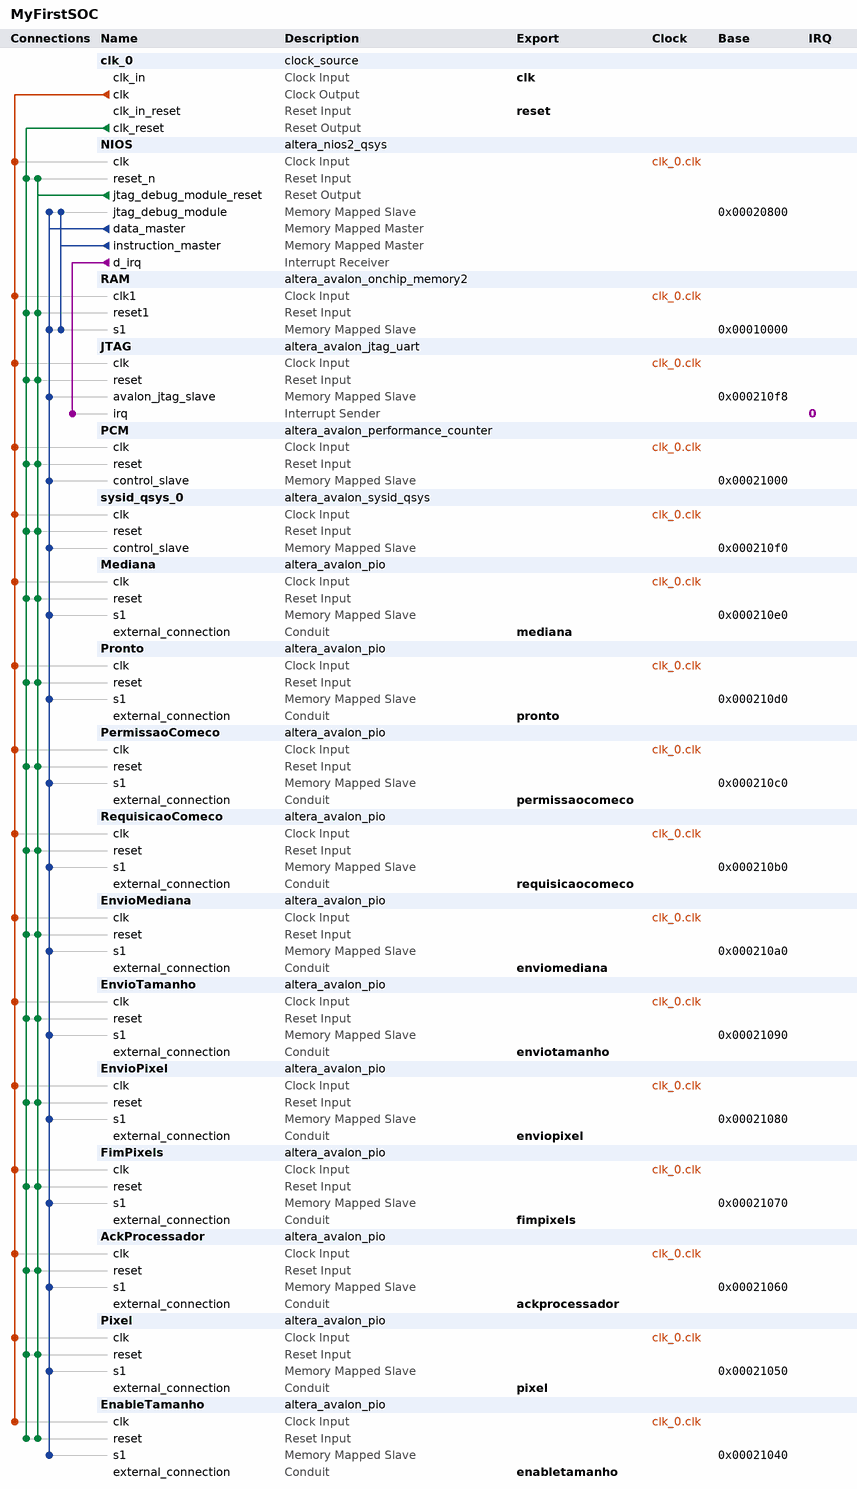
[diagram p0: system contents]
# Platform Designer (Qsys) system MyFirstSOC, Cyclone III EP3C25F324C6
# Parameters at their usual value, and those the tool derives, are not listed.
package require -exact qsys 13.1
create_system MyFirstSOC
set_project_property DEVICE_FAMILY {Cyclone III}
set_project_property DEVICE EP3C25F324C6

add_instance clk_0 clock_source 13.1
set_instance_parameter_value clk_0 clockFrequency 50000000

add_instance NIOS altera_nios2_qsys 13.1
set_instance_parameter_value NIOS resetSlave RAM.s1
set_instance_parameter_value NIOS mmu_TLBMissExcSlave None
set_instance_parameter_value NIOS exceptionSlave RAM.s1
set_instance_parameter_value NIOS breakSlave NIOS.jtag_debug_module
set_instance_parameter_value NIOS impl Tiny
set_instance_parameter_value NIOS icache_size 4096

add_instance RAM altera_avalon_onchip_memory2 13.1
set_instance_parameter_value RAM dataWidth 16
set_instance_parameter_value RAM dualPort false
set_instance_parameter_value RAM initMemContent true
set_instance_parameter_value RAM initializationFileName onchip_mem.hex
set_instance_parameter_value RAM memorySize 40960

add_instance JTAG altera_avalon_jtag_uart 13.1
set_instance_parameter_value JTAG simInteractiveOptions NO_INTERACTIVE_WINDOWS

add_instance PCM altera_avalon_performance_counter 13.1
set_instance_parameter_value PCM numberOfSections 3

add_instance sysid_qsys_0 altera_avalon_sysid_qsys 13.1
set_instance_parameter_value sysid_qsys_0 id 0

add_instance Mediana altera_avalon_pio 13.1
set_instance_parameter_value Mediana direction Output
set_instance_parameter_value Mediana width 8

add_instance Pronto altera_avalon_pio 13.1
set_instance_parameter_value Pronto direction Output
set_instance_parameter_value Pronto width 1

add_instance PermissaoComeco altera_avalon_pio 13.1
set_instance_parameter_value PermissaoComeco direction Output
set_instance_parameter_value PermissaoComeco width 1

add_instance RequisicaoComeco altera_avalon_pio 13.1
set_instance_parameter_value RequisicaoComeco direction Input
set_instance_parameter_value RequisicaoComeco width 1

add_instance EnvioMediana altera_avalon_pio 13.1
set_instance_parameter_value EnvioMediana direction Input
set_instance_parameter_value EnvioMediana width 1

add_instance EnvioTamanho altera_avalon_pio 13.1
set_instance_parameter_value EnvioTamanho direction Input
set_instance_parameter_value EnvioTamanho width 1

add_instance EnvioPixel altera_avalon_pio 13.1
set_instance_parameter_value EnvioPixel direction Input
set_instance_parameter_value EnvioPixel width 1

add_instance FimPixels altera_avalon_pio 13.1
set_instance_parameter_value FimPixels direction Input
set_instance_parameter_value FimPixels width 1

add_instance AckProcessador altera_avalon_pio 13.1
set_instance_parameter_value AckProcessador direction Input
set_instance_parameter_value AckProcessador width 1

add_instance Pixel altera_avalon_pio 13.1
set_instance_parameter_value Pixel direction Input
set_instance_parameter_value Pixel width 8

add_instance EnableTamanho altera_avalon_pio 13.1
set_instance_parameter_value EnableTamanho direction Input
set_instance_parameter_value EnableTamanho width 2

# connections
add_connection clk_0.clk AckProcessador.clk clock
add_connection clk_0.clk EnableTamanho.clk clock
add_connection clk_0.clk EnvioMediana.clk clock
add_connection clk_0.clk EnvioPixel.clk clock
add_connection clk_0.clk EnvioTamanho.clk clock
add_connection clk_0.clk FimPixels.clk clock
add_connection clk_0.clk JTAG.clk clock
add_connection clk_0.clk Mediana.clk clock
add_connection clk_0.clk NIOS.clk clock
add_connection clk_0.clk PCM.clk clock
add_connection clk_0.clk PermissaoComeco.clk clock
add_connection clk_0.clk Pixel.clk clock
add_connection clk_0.clk Pronto.clk clock
add_connection clk_0.clk RAM.clk1 clock
add_connection clk_0.clk RequisicaoComeco.clk clock
add_connection clk_0.clk sysid_qsys_0.clk clock
add_connection clk_0.clk_reset AckProcessador.reset reset
add_connection clk_0.clk_reset EnableTamanho.reset reset
add_connection clk_0.clk_reset EnvioMediana.reset reset
add_connection clk_0.clk_reset EnvioPixel.reset reset
add_connection clk_0.clk_reset EnvioTamanho.reset reset
add_connection clk_0.clk_reset FimPixels.reset reset
add_connection clk_0.clk_reset JTAG.reset reset
add_connection clk_0.clk_reset Mediana.reset reset
add_connection clk_0.clk_reset NIOS.reset_n reset
add_connection clk_0.clk_reset PCM.reset reset
add_connection clk_0.clk_reset PermissaoComeco.reset reset
add_connection clk_0.clk_reset Pixel.reset reset
add_connection clk_0.clk_reset Pronto.reset reset
add_connection clk_0.clk_reset RAM.reset1 reset
add_connection clk_0.clk_reset RequisicaoComeco.reset reset
add_connection clk_0.clk_reset sysid_qsys_0.reset reset
add_connection NIOS.jtag_debug_module_reset AckProcessador.reset reset
add_connection NIOS.jtag_debug_module_reset EnableTamanho.reset reset
add_connection NIOS.jtag_debug_module_reset EnvioMediana.reset reset
add_connection NIOS.jtag_debug_module_reset EnvioPixel.reset reset
add_connection NIOS.jtag_debug_module_reset EnvioTamanho.reset reset
add_connection NIOS.jtag_debug_module_reset FimPixels.reset reset
add_connection NIOS.jtag_debug_module_reset JTAG.reset reset
add_connection NIOS.jtag_debug_module_reset Mediana.reset reset
add_connection NIOS.jtag_debug_module_reset NIOS.reset_n reset
add_connection NIOS.jtag_debug_module_reset PCM.reset reset
add_connection NIOS.jtag_debug_module_reset PermissaoComeco.reset reset
add_connection NIOS.jtag_debug_module_reset Pixel.reset reset
add_connection NIOS.jtag_debug_module_reset Pronto.reset reset
add_connection NIOS.jtag_debug_module_reset RAM.reset1 reset
add_connection NIOS.jtag_debug_module_reset RequisicaoComeco.reset reset
add_connection NIOS.jtag_debug_module_reset sysid_qsys_0.reset reset
add_connection NIOS.data_master AckProcessador.s1 avalon
set_connection_parameter_value NIOS.data_master/AckProcessador.s1 baseAddress 0x00021060
add_connection NIOS.data_master EnableTamanho.s1 avalon
set_connection_parameter_value NIOS.data_master/EnableTamanho.s1 baseAddress 0x00021040
add_connection NIOS.data_master EnvioMediana.s1 avalon
set_connection_parameter_value NIOS.data_master/EnvioMediana.s1 baseAddress 0x000210a0
add_connection NIOS.data_master EnvioPixel.s1 avalon
set_connection_parameter_value NIOS.data_master/EnvioPixel.s1 baseAddress 0x00021080
add_connection NIOS.data_master EnvioTamanho.s1 avalon
set_connection_parameter_value NIOS.data_master/EnvioTamanho.s1 baseAddress 0x00021090
add_connection NIOS.data_master FimPixels.s1 avalon
set_connection_parameter_value NIOS.data_master/FimPixels.s1 baseAddress 0x00021070
add_connection NIOS.data_master JTAG.avalon_jtag_slave avalon
set_connection_parameter_value NIOS.data_master/JTAG.avalon_jtag_slave baseAddress 0x000210f8
add_connection NIOS.data_master Mediana.s1 avalon
set_connection_parameter_value NIOS.data_master/Mediana.s1 baseAddress 0x000210e0
add_connection NIOS.data_master NIOS.jtag_debug_module avalon
set_connection_parameter_value NIOS.data_master/NIOS.jtag_debug_module baseAddress 0x00020800
add_connection NIOS.data_master PCM.control_slave avalon
set_connection_parameter_value NIOS.data_master/PCM.control_slave baseAddress 0x00021000
add_connection NIOS.data_master PermissaoComeco.s1 avalon
set_connection_parameter_value NIOS.data_master/PermissaoComeco.s1 baseAddress 0x000210c0
add_connection NIOS.data_master Pixel.s1 avalon
set_connection_parameter_value NIOS.data_master/Pixel.s1 baseAddress 0x00021050
add_connection NIOS.data_master Pronto.s1 avalon
set_connection_parameter_value NIOS.data_master/Pronto.s1 baseAddress 0x000210d0
add_connection NIOS.data_master RAM.s1 avalon
set_connection_parameter_value NIOS.data_master/RAM.s1 baseAddress 0x00010000
add_connection NIOS.data_master RequisicaoComeco.s1 avalon
set_connection_parameter_value NIOS.data_master/RequisicaoComeco.s1 baseAddress 0x000210b0
add_connection NIOS.data_master sysid_qsys_0.control_slave avalon
set_connection_parameter_value NIOS.data_master/sysid_qsys_0.control_slave baseAddress 0x000210f0
add_connection NIOS.instruction_master NIOS.jtag_debug_module avalon
set_connection_parameter_value NIOS.instruction_master/NIOS.jtag_debug_module baseAddress 0x00020800
add_connection NIOS.instruction_master RAM.s1 avalon
set_connection_parameter_value NIOS.instruction_master/RAM.s1 baseAddress 0x00010000
add_connection NIOS.d_irq JTAG.irq interrupt
set_connection_parameter_value NIOS.d_irq/JTAG.irq irqNumber 0

# exported interfaces
add_interface clk clock sink
set_interface_property clk EXPORT_OF clk_0.clk_in
add_interface reset reset sink
set_interface_property reset EXPORT_OF clk_0.clk_in_reset
add_interface pronto conduit end
set_interface_property pronto EXPORT_OF Pronto.external_connection
add_interface permissaocomeco conduit end
set_interface_property permissaocomeco EXPORT_OF PermissaoComeco.external_connection
add_interface requisicaocomeco conduit end
set_interface_property requisicaocomeco EXPORT_OF RequisicaoComeco.external_connection
add_interface mediana conduit end
set_interface_property mediana EXPORT_OF Mediana.external_connection
add_interface enviomediana conduit end
set_interface_property enviomediana EXPORT_OF EnvioMediana.external_connection
add_interface enviotamanho conduit end
set_interface_property enviotamanho EXPORT_OF EnvioTamanho.external_connection
add_interface enviopixel conduit end
set_interface_property enviopixel EXPORT_OF EnvioPixel.external_connection
add_interface fimpixels conduit end
set_interface_property fimpixels EXPORT_OF FimPixels.external_connection
add_interface ackprocessador conduit end
set_interface_property ackprocessador EXPORT_OF AckProcessador.external_connection
add_interface pixel conduit end
set_interface_property pixel EXPORT_OF Pixel.external_connection
add_interface enabletamanho conduit end
set_interface_property enabletamanho EXPORT_OF EnableTamanho.external_connection

set_interconnect_requirement {$system} qsys_mm.clockCrossingAdapter HANDSHAKE
set_interconnect_requirement {$system} qsys_mm.maxAdditionalLatency 1
set_interconnect_requirement {$system} qsys_mm.insertDefaultSlave false

save_system MyFirstSOC.qsys
